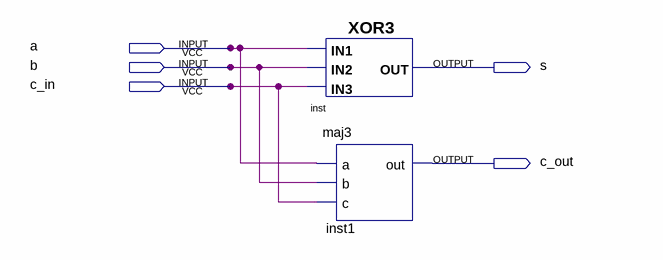
[diagram p0: schematic sheet]
// Quartus schematic full_adder.bdf as structural Verilog: 2 symbols, 5 pins
module full_adder (
  input  a,
  input  b,
  input  c_in,
  output s,
  output c_out
);

  XOR3 inst (.IN3(c_in), .IN1(a), .IN2(b), .OUT(s));
  maj3 inst1 (.a(a), .b(b), .c(c_in), .out(c_out));
endmodule
